# Altium project Pico_VNA.PrjPcb
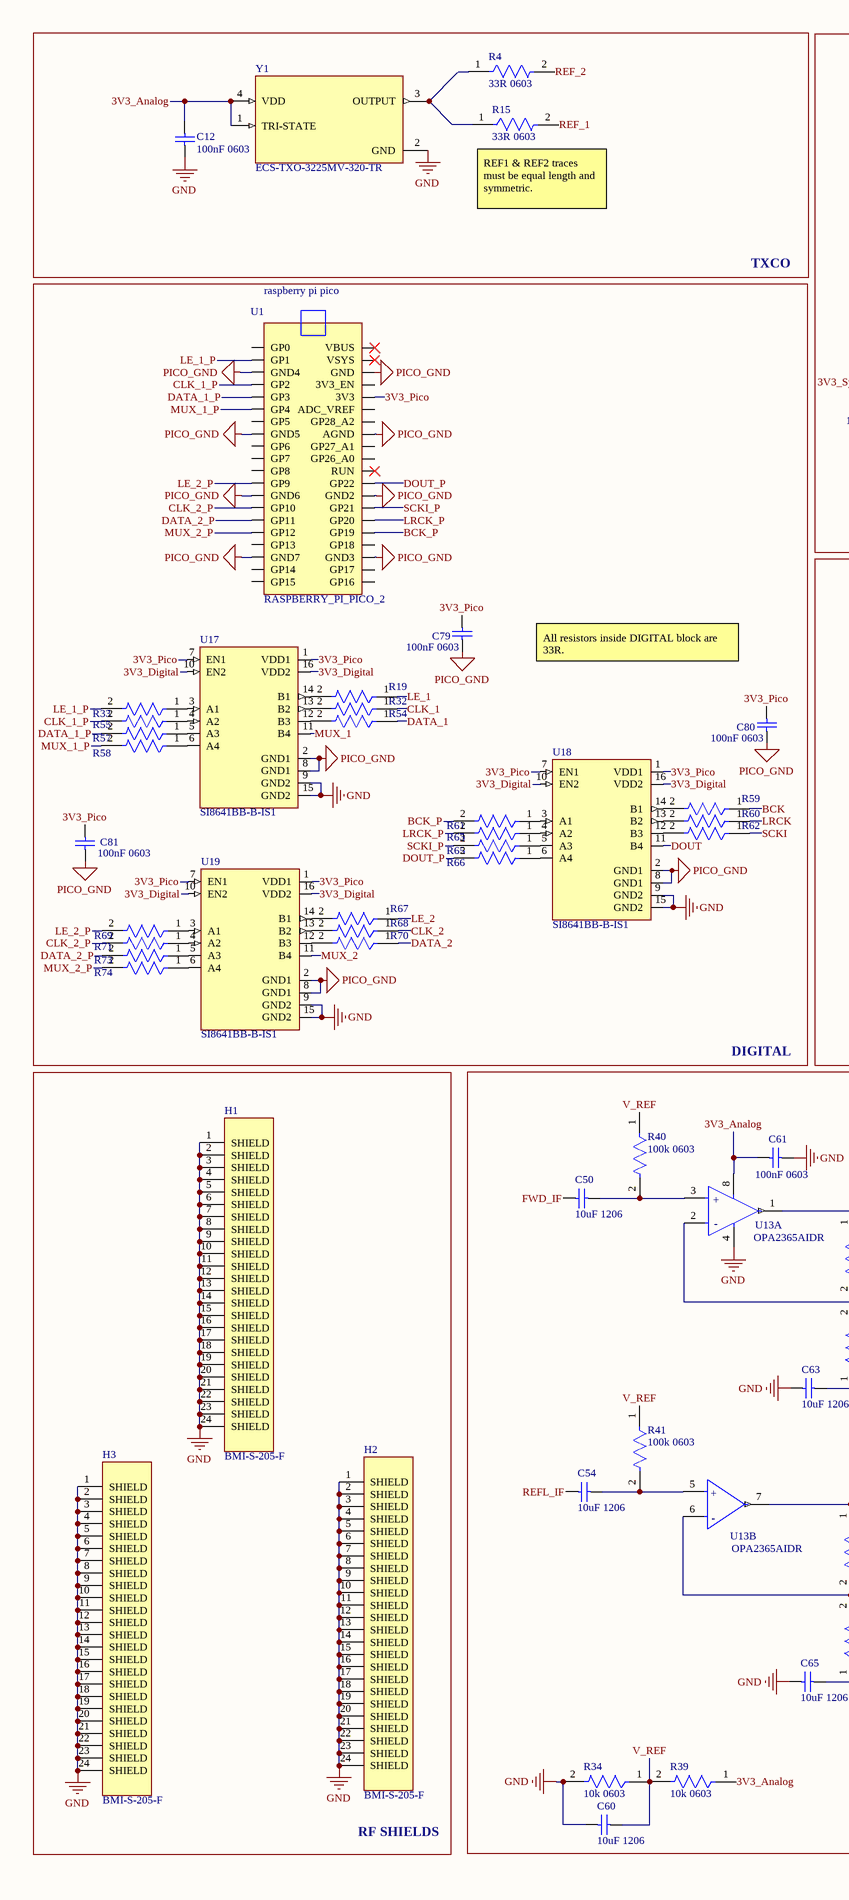
[diagram p0: Main.SchDoc, left]
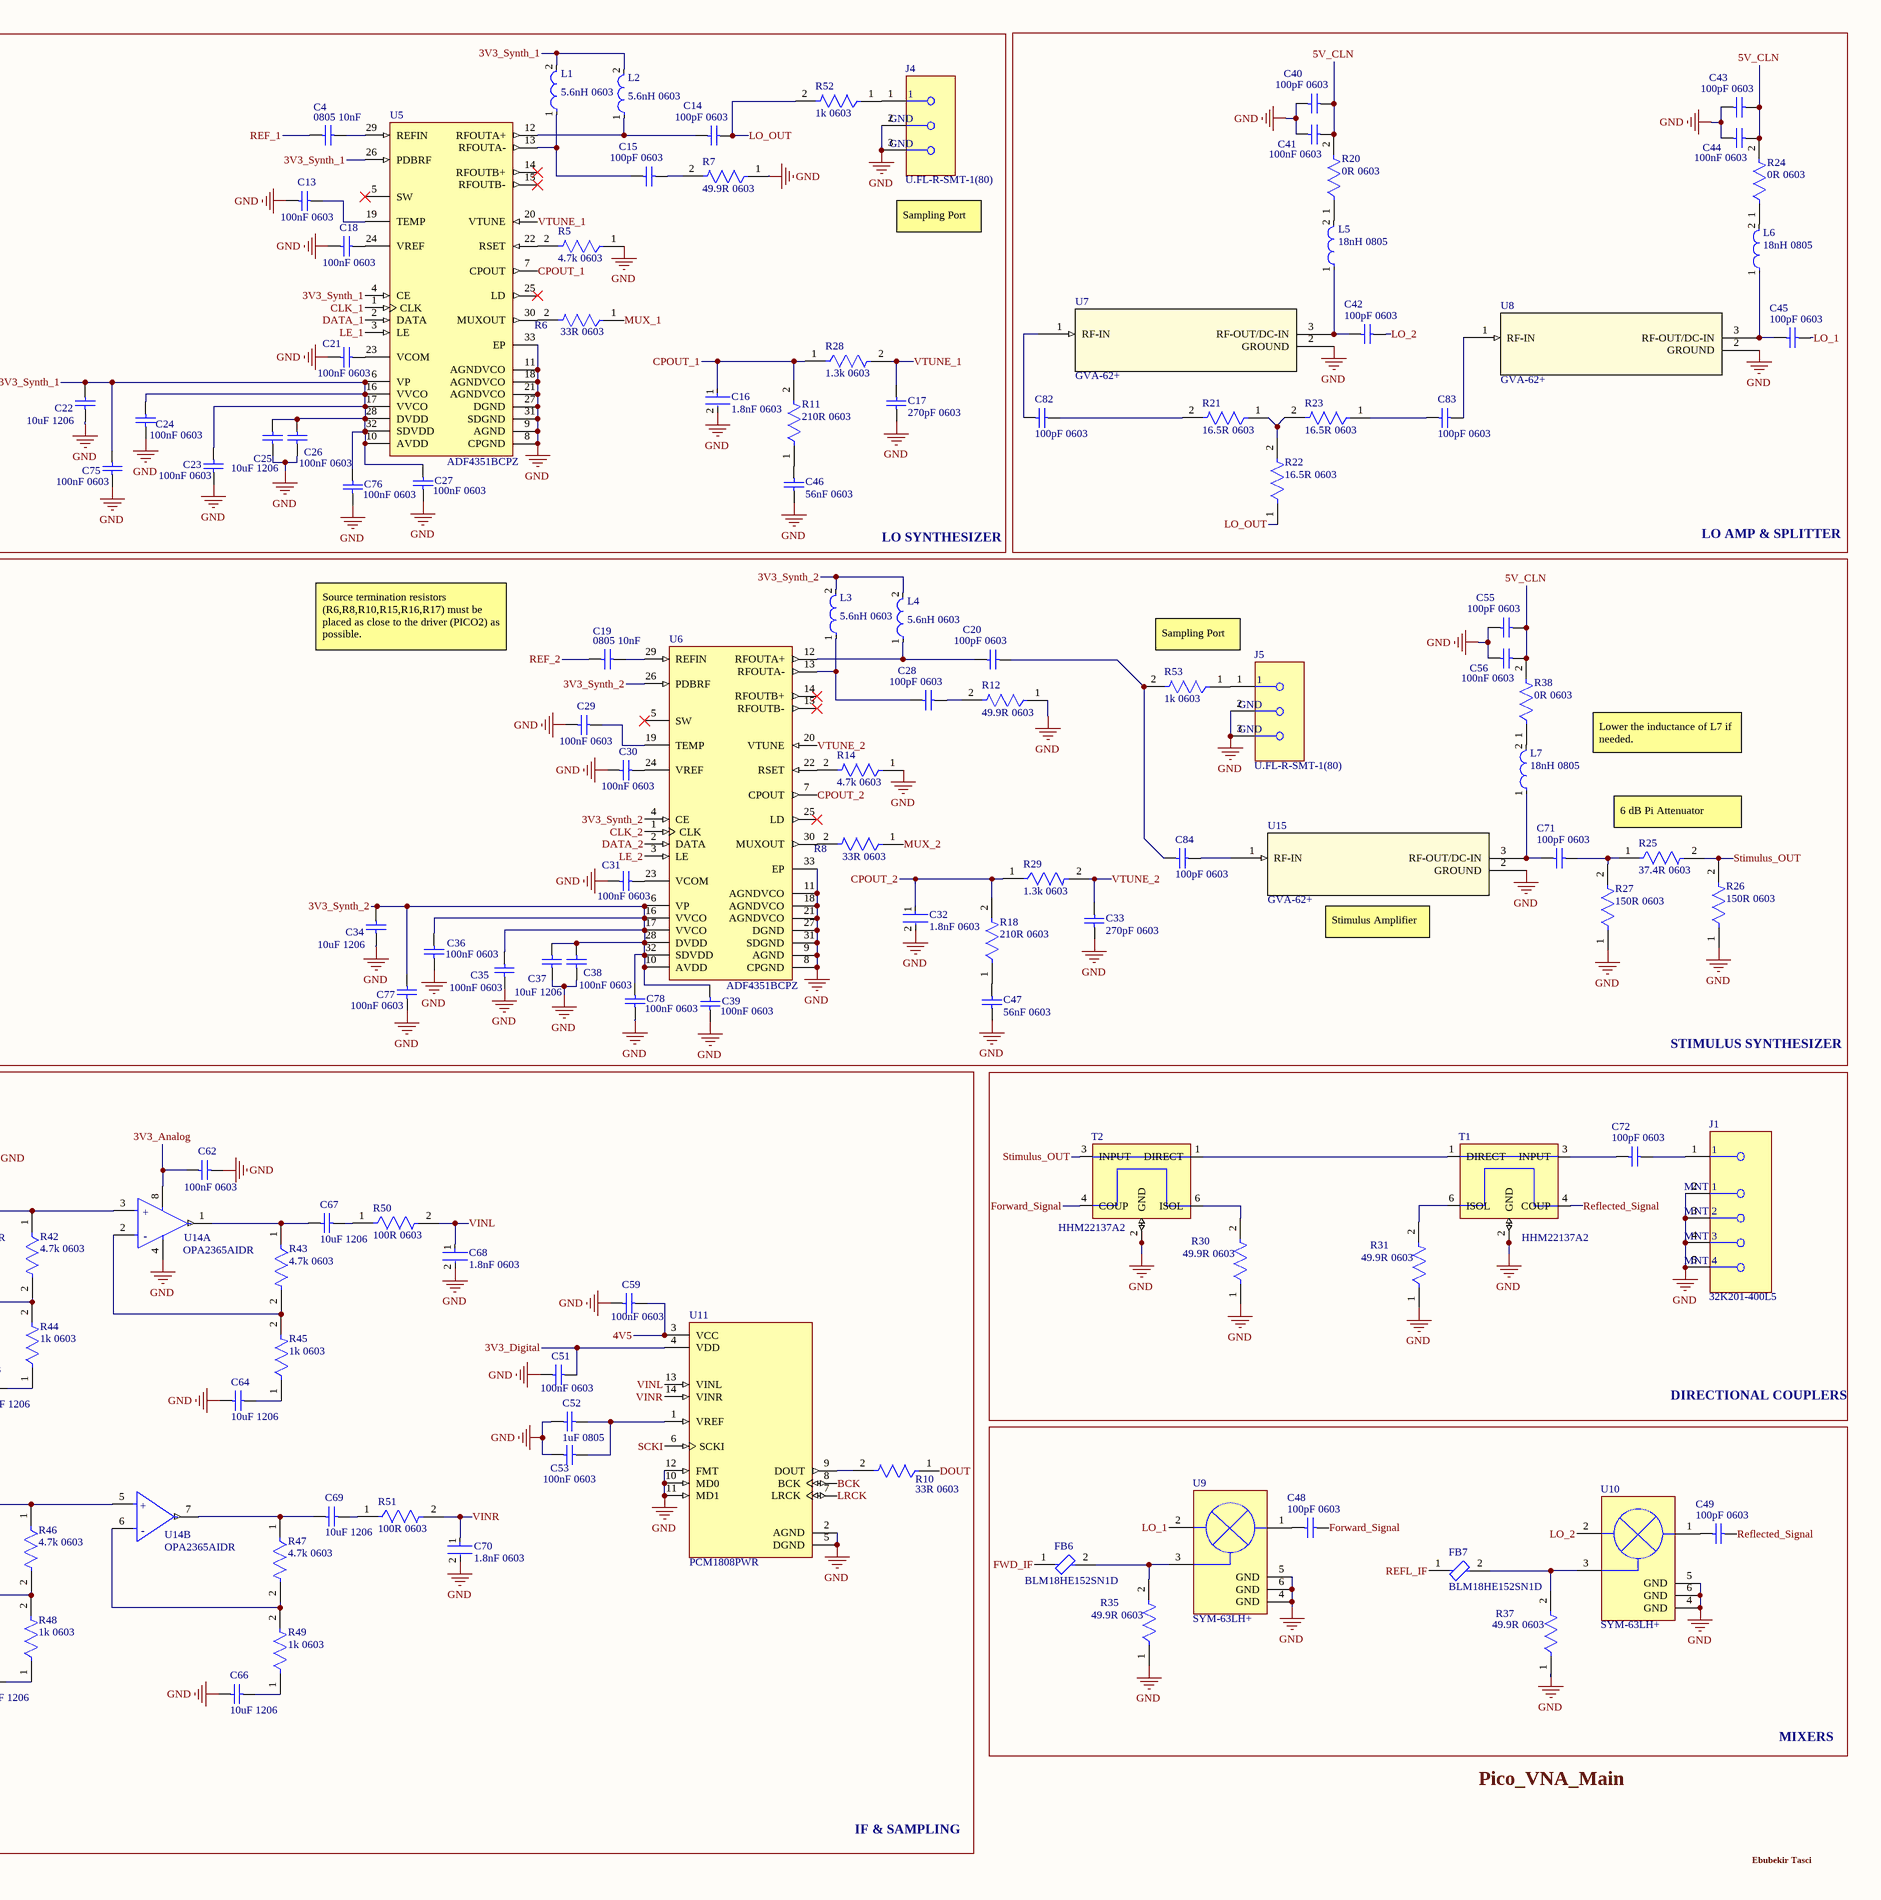
[diagram p1: Main.SchDoc, right]
2 sheets, 199 parts. Net scope: global (net labels, ports and power ports of the same name join across sheets).
Board file: Main.PcbDoc
Sheets:
  Main.SchDoc
  Power.SchDoc

## Sheet Main.SchDoc
size A2; SheetNumber: 1; SheetTotal: 2

### Parts
C4  0805 10nF  [CAPC2013X94X50ML20T25]
C12  100nF 0603  [CAPC0603(1608)100_N]
C13  100nF 0603  [CAPC0603(1608)100_N]
C14  100pF 0603  [CAPC1608X92X38LL15T08]
C15  100pF 0603  [CAPC1608X92X38LL15T08]
C16  1.8nF 0603  [FP-C0603C-CF-MFG]
C17  270pF 0603  [CAPC1608X92X38LL15T08]
C18  100nF 0603  [CAPC0603(1608)100_N]
C19  0805 10nF  [CAPC2013X94X50ML20T25]
C20  100pF 0603  [CAPC1608X92X38LL15T08]
C21  100nF 0603  [CAPC0603(1608)100_N]
C22  10uF 1206  [CAPC1206(3216)190_M]
C23  100nF 0603  [CAPC0603(1608)100_N]
C24  100nF 0603  [CAPC0603(1608)100_N]
C25  10uF 1206  [CAPC1206(3216)190_M]
C26  100nF 0603  [CAPC0603(1608)100_L]
C27  100nF 0603  [CAPC0603(1608)100_L]
C28  100pF 0603  [CAPC1608X92X38LL15T08]
C29  100nF 0603  [CAPC0603(1608)100_N]
C30  100nF 0603  [CAPC0603(1608)100_N]
C31  100nF 0603  [CAPC0603(1608)100_N]
C32  1.8nF 0603  [FP-C0603C-CF-MFG]
C33  270pF 0603  [CAPC1608X92X38LL15T08]
C34  10uF 1206  [CAPC1206(3216)190_M]
C35  100nF 0603  [CAPC0603(1608)100_N]
C36  100nF 0603  [CAPC0603(1608)100_N]
C37  10uF 1206  [CAPC1206(3216)190_M]
C38  100nF 0603  [CAPC0603(1608)100_L]
C39  100nF 0603  [CAPC0603(1608)100_L]
C40  100pF 0603  [CAPC1608X92X38LL15T08]
C41  100nF 0603  [CAPC0603(1608)100_N]
C42  100pF 0603  [CAPC1608X92X38LL15T08]
C43  100pF 0603  [CAPC1608X92X38LL15T08]
C44  100nF 0603  [CAPC0603(1608)100_N]
C45  100pF 0603  [CAPC1608X92X38LL15T08]
C46  56nF 0603  [CAPC1608X90X35LL15T15]
C47  56nF 0603  [CAPC1608X90X35LL15T15]
C48  100pF 0603  [CAPC1608X92X38LL15T08]
C49  100pF 0603  [CAPC1608X92X38LL15T08]
C50  10uF 1206  [CAPC1206(3216)190_M]
C51  100nF 0603  [CAPC0603(1608)100_N]
C52  1uF 0805  [CAPC2013X145X50NL20T25]
C53  100nF 0603  [CAPC0603(1608)100_N]
C54  10uF 1206  [CAPC1206(3216)190_M]
C55  100pF 0603  [CAPC1608X92X38LL15T08]
C56  100nF 0603  [CAPC0603(1608)100_N]
C59  100nF 0603  [CAPC0603(1608)100_N]
C60  10uF 1206  [CAPC1206(3216)190_M]
C61  100nF 0603  [CAPC0603(1608)100_N]
C62  100nF 0603  [CAPC0603(1608)100_N]
C63  10uF 1206  [CAPC1206(3216)190_M]
C64  10uF 1206  [CAPC1206(3216)190_M]
C65  10uF 1206  [CAPC1206(3216)190_M]
C66  10uF 1206  [CAPC1206(3216)190_M]
C67  10uF 1206  [CAPC1206(3216)190_M]
C68  1.8nF 0603  [FP-C0603C-CF-MFG]
C69  10uF 1206  [CAPC1206(3216)190_M]
C70  1.8nF 0603  [FP-C0603C-CF-MFG]
C71  100pF 0603  [CAPC1608X92X38LL15T08]
C72  100pF 0603  [CAPC1608X92X38LL15T08]
C75  100nF 0603  [CAPC0603(1608)100_N]
C76  100nF 0603  [CAPC0603(1608)100_L]
C77  100nF 0603  [CAPC0603(1608)100_N]
C78  100nF 0603  [CAPC0603(1608)100_L]
C79  100nF 0603  [CAPC0603(1608)100_N]
C80  100nF 0603  [CAPC0603(1608)100_N]
C81  100nF 0603  [CAPC0603(1608)100_N]
C82  100pF 0603  [CAPC1608X92X38LL15T08]
C83  100pF 0603  [CAPC1608X92X38LL15T08]
C84  100pF 0603  [CAPC1608X92X38LL15T08]
FB6  BLM18HE152SN1D  [FP-BLM18-0_15-t0_8-IPC_C]
FB7  BLM18HE152SN1D  [FP-BLM18-0_15-t0_8-IPC_C]
H1  BMI-S-205-F  [LAIRD_BMI-S-205-F]
H2  BMI-S-205-F  [LAIRD_BMI-S-205-F]
H3  BMI-S-205-F  [LAIRD_BMI-S-205-F]
J1  32K201-400L5  [FP-32K201-400L5-MFG]
J4  U.FL-R-SMT-1(80)  [FP-U_FL-R-SMT-1_80-MFG]
J5  U.FL-R-SMT-1(80)  [FP-U_FL-R-SMT-1_80-MFG]
L1  5.6nH 0603  [FP-AISC-0603HP-MFG]
L2  5.6nH 0603  [FP-AISC-0603HP-MFG]
L3  5.6nH 0603  [FP-AISC-0603HP-MFG]
L4  5.6nH 0603  [FP-AISC-0603HP-MFG]
L5  18nH 0805  [FP-LQW2BAN_00-MFG]
L6  18nH 0805  [FP-LQW2BAN_00-MFG]
L7  18nH 0805  [FP-LQW2BAN_00-MFG]
R4  33R 0603  [FP-SR0603-MFG]
R5  4.7k 0603  [FP-CPF0603-MFG]
R6  33R 0603  [FP-CPF0603-MFG]
R7  49.9R 0603  [FP-RT0603-MFG]
R8  33R 0603  [FP-CPF0603-MFG]
R10  33R 0603  [FP-CPF0603-MFG]
R11  210R 0603  [FP-AC0603-IPC_B]
R12  49.9R 0603  [FP-RT0603-MFG]
R14  4.7k 0603  [FP-CPF0603-MFG]
R15  33R 0603  [FP-SR0603-MFG]
R18  210R 0603  [FP-AC0603-IPC_B]
R19  33R 0603  [FP-CPF0603-MFG]  (value not drawn)
R20  0R 0603  [FP-HCJ0603-MFG]
R21  16.5R 0603  [FP-RT0603-MFG]
R22  16.5R 0603  [FP-RT0603-MFG]
R23  16.5R 0603  [FP-RT0603-MFG]
R24  0R 0603  [FP-HCJ0603-MFG]
R25  37.4R 0603  [FP-RT0603-MFG]
R26  150R 0603  [FP-RT0603-MFG]
R27  150R 0603  [FP-RT0603-MFG]
R28  1.3k 0603  [FP-TFCR0603-IPC_B]
R29  1.3k 0603  [FP-TFCR0603-IPC_B]
R30  49.9R 0603  [FP-RT0603-MFG]
R31  49.9R 0603  [FP-RT0603-MFG]
R32  33R 0603  [FP-CPF0603-MFG]  (value not drawn)
R33  33R 0603  [FP-CPF0603-MFG]  (value not drawn)
R34  10k 0603  [FP-RT0603-MFG]
R35  49.9R 0603  [FP-RT0603-MFG]
R37  49.9R 0603  [FP-RT0603-MFG]
R38  0R 0603  [FP-HCJ0603-MFG]
R39  10k 0603  [FP-RT0603-MFG]
R40  100k 0603  [FP-RT0603-MFG]
R41  100k 0603  [FP-RT0603-MFG]
R42  4.7k 0603  [FP-CPF0603-MFG]
R43  4.7k 0603  [FP-CPF0603-MFG]
R44  1k 0603  [FP-TFCR0603-MFG]
R45  1k 0603  [FP-TFCR0603-MFG]
R46  4.7k 0603  [FP-CPF0603-MFG]
R47  4.7k 0603  [FP-CPF0603-MFG]
R48  1k 0603  [FP-TFCR0603-MFG]
R49  1k 0603  [FP-TFCR0603-MFG]
R50  100R 0603  [FP-MCT0603-MFG]
R51  100R 0603  [FP-MCT0603-MFG]
R52  1k 0603  [FP-TFCR0603-MFG]
R53  1k 0603  [FP-TFCR0603-MFG]
R54  33R 0603  [FP-CPF0603-MFG]  (value not drawn)
R55  33R 0603  [FP-CPF0603-MFG]  (value not drawn)
R57  33R 0603  [FP-CPF0603-MFG]  (value not drawn)
R58  33R 0603  [FP-CPF0603-MFG]  (value not drawn)
R59  33R 0603  [FP-CPF0603-MFG]  (value not drawn)
R60  33R 0603  [FP-CPF0603-MFG]  (value not drawn)
R61  33R 0603  [FP-CPF0603-MFG]  (value not drawn)
R62  33R 0603  [FP-CPF0603-MFG]  (value not drawn)
R63  33R 0603  [FP-CPF0603-MFG]  (value not drawn)
R65  33R 0603  [FP-CPF0603-MFG]  (value not drawn)
R66  33R 0603  [FP-CPF0603-MFG]  (value not drawn)
R67  33R 0603  [FP-CPF0603-MFG]  (value not drawn)
R68  33R 0603  [FP-CPF0603-MFG]  (value not drawn)
R69  33R 0603  [FP-CPF0603-MFG]  (value not drawn)
R70  33R 0603  [FP-CPF0603-MFG]  (value not drawn)
R71  33R 0603  [FP-CPF0603-MFG]  (value not drawn)
R73  33R 0603  [FP-CPF0603-MFG]  (value not drawn)
R74  33R 0603  [FP-CPF0603-MFG]  (value not drawn)
T1  HHM22137A2  [HHM22137A2]
T2  HHM22137A2  [HHM22137A2]
U1  RASPBERRY_PI_PICO_2  [RASPBERRY_PI_PICO]
U5  ADF4351BCPZ  [ADI-CP-32-2_N]
U6  ADF4351BCPZ  [ADI-CP-32-2_N]
U7  GVA-62+  [DF782_MNC]
U8  GVA-62+  [DF782_MNC]
U9  SYM-63LH+  [FP-SYM-30DMHW+-MFG]
U10  SYM-63LH+  [FP-SYM-30DMHW+-MFG]
U11  PCM1808PWR  [SOP65P640X120-14N]
U13  OPA2365AIDR  [FP-D0008A-MFG]  (parts A,B of 2)
U14  OPA2365AIDR  [FP-D0008A-MFG]  (parts A,B of 2)
U15  GVA-62+  [DF782_MNC]
U17  SI8641BB-B-IS1  [SOIC127P600X265-16N]
U18  SI8641BB-B-IS1  [SOIC127P600X265-16N]
U19  SI8641BB-B-IS1  [SOIC127P600X265-16N]
Y1  ECS-TXO-3225MV-320-TR  [OSC_ECS-TXO-3225MV-320-TR]

### Blocks framed on the sheet
TXCO: C12 R4 R15 Y1
LO SYNTHESIZER: C4 C13-C18 C21-C27 C46 C75 C76 J4 L1 L2 R5-R7 R11 R28 R52 U5
LO AMP & SPLITTER: C40-C45 C82 C83 L5 L6 R20-R24 U7 U8
DIGITAL: C79-C81 R19 R32 R33 R54 R55 R57-R63 R65-R71 R73 R74 U1 U17-U19
STIMULUS SYNTHESIZER: C19 C20 C28-C39 C47 C55 C56 C71 C77 C78 C84 J5 L3 L4 L7 R8 R12 R14 R18 R25-R27 R29 R38 R53 U6 U15
RF SHIELDS: H1-H3
IF & SAMPLING: C50-C54 C59-C70 R10 R34 R39-R51 U11 U13 U14
DIRECTIONAL COUPLERS: C72 J1 R30 R31 T1 T2
MIXERS: C48 C49 FB6 FB7 R35 R37 U9 U10

### Nets
GND: C12.1 C13.2 C16.2 C17.1 C18.2 C21.2 C22.2 C23.1 C24.1 C25.1 C26.2 C27.2 C29.2 C30.2 C31.2 C32.2 C33.1 C34.2 C35.1 C36.1 C37.1 C38.2 C39.2 C40.1 C41.1 C43.1 C44.1 C46.1 C47.1 C51.1 C52.1 C53.1 C55.1 C56.1 C59.1 C60.1 C61.1 C62.1 C63.1 C64.1 C65.1 C66.1 C68.2 C70.2 C75.1 C76.2 C77.1 C78.2 H1.1(SHIELD) H1.2(SHIELD) H1.3(SHIELD) H1.4(SHIELD) H1.5(SHIELD) H1.6(SHIELD) H1.7(SHIELD) H1.8(SHIELD) H1.9(SHIELD) H1.10(SHIELD) H1.11(SHIELD) H1.12(SHIELD) H1.13(SHIELD) H1.14(SHIELD) H1.15(SHIELD) H1.16(SHIELD) H1.17(SHIELD) H1.18(SHIELD) H1.19(SHIELD) H1.20(SHIELD) H1.21(SHIELD) H1.22(SHIELD) H1.23(SHIELD) H1.24(SHIELD) H2.1(SHIELD) H2.2(SHIELD) H2.3(SHIELD) H2.4(SHIELD) H2.5(SHIELD) H2.6(SHIELD) H2.7(SHIELD) H2.8(SHIELD) H2.9(SHIELD) H2.10(SHIELD) H2.11(SHIELD) H2.12(SHIELD) H2.13(SHIELD) H2.14(SHIELD) H2.15(SHIELD) H2.16(SHIELD) H2.17(SHIELD) H2.18(SHIELD) H2.19(SHIELD) H2.20(SHIELD) H2.21(SHIELD) H2.22(SHIELD) H2.23(SHIELD) H2.24(SHIELD) H3.1(SHIELD) H3.2(SHIELD) H3.3(SHIELD) H3.4(SHIELD) H3.5(SHIELD) H3.6(SHIELD) H3.7(SHIELD) H3.8(SHIELD) H3.9(SHIELD) H3.10(SHIELD) H3.11(SHIELD) H3.12(SHIELD) H3.13(SHIELD) H3.14(SHIELD) H3.15(SHIELD) H3.16(SHIELD) H3.17(SHIELD) H3.18(SHIELD) H3.19(SHIELD) H3.20(SHIELD) H3.21(SHIELD) H3.22(SHIELD) H3.23(SHIELD) H3.24(SHIELD) J1.2(MNT_1) J1.3(MNT_2) J1.4(MNT_3) J1.5(MNT_4) J4.2(GND) J4.3(GND) J5.2(GND) J5.3(GND) R5.1 R7.1 R12.1 R14.1 R26.1 R27.1 R30.1 R31.1 R34.2 R35.1 R37.1 T1.2(GND) T1.5(GND) T2.2(GND) T2.5(GND) U5.8(CPGND) U5.9(AGND) U5.11(AGNDVCO) U5.18(AGNDVCO) U5.21(AGNDVCO) U5.27(DGND) U5.31(SDGND) U5.33(EP) U6.8(CPGND) U6.9(AGND) U6.11(AGNDVCO) U6.18(AGNDVCO) U6.21(AGNDVCO) U6.27(DGND) U6.31(SDGND) U6.33(EP) U7.2(GROUND) U8.2(GROUND) U9.4(GND) U9.5(GND) U9.6(GND) U10.4(GND) U10.5(GND) U10.6(GND) U11.2(AGND) U11.5(DGND) U11.10(MD0) U11.11(MD1) U11.12(FMT) U13.4(V-) U14.4(V-) U15.2(GROUND) U17.9(GND2) U17.15(GND2) U18.9(GND2) U18.15(GND2) U19.9(GND2) U19.15(GND2) Y1.2(GND)
PICO_GND: C79.1 C80.1 C81.1 U1.AGND U1.GND U1.GND2 U1.GND3 U1.GND4 U1.GND5 U1.GND6 U1.GND7 U17.2(GND1) U17.8(GND1) U18.2(GND1) U18.8(GND1) U19.2(GND1) U19.8(GND1)
3V3_Analog: C12.2 C61.2 C62.2 R39.1 U13.8(V+) U14.8(V+) Y1.1(TRI-STATE) Y1.4(VDD)
3V3_Digital: C51.2 U11.4(VDD) U17.10(EN2) U17.16(VDD2) U18.10(EN2) U18.16(VDD2) U19.10(EN2) U19.16(VDD2)
3V3_Pico: C79.2 C80.2 C81.2 U1.3V3 U17.1(VDD1) U17.7(EN1) U18.1(VDD1) U18.7(EN1) U19.1(VDD1) U19.7(EN1)
3V3_Synth_1: C22.1 C23.2 C24.2 C25.2 C26.1 C27.1 C75.2 C76.1 L1.2 L2.2 U5.4(CE) U5.6(VP) U5.10(AVDD) U5.16(VVCO) U5.17(VVCO) U5.26(PDBRF) U5.28(DVDD) U5.32(SDVDD)
3V3_Synth_2: C34.1 C35.2 C36.2 C37.2 C38.1 C39.1 C77.2 C78.1 L3.2 L4.2 U6.4(CE) U6.6(VP) U6.10(AVDD) U6.16(VVCO) U6.17(VVCO) U6.26(PDBRF) U6.28(DVDD) U6.32(SDVDD)
4V5: C59.2 U11.3(VCC)
5V_CLN: C40.2 C41.2 C43.2 C44.2 C55.2 C56.2 R20.2 R24.2 R38.2
BCK: R59.1 U11.8(BCK)
BCK_P: R61.2 U1.GP19
CLK_1: R32.1 U5.1(CLK)
CLK_1_P: R55.2 U1.GP2
CLK_2: R68.1 U6.1(CLK)
CLK_2_P: R71.2 U1.GP10
CPOUT_1: C16.1 R11.2 R28.1 U5.7(CPOUT)
CPOUT_2: C32.1 R18.2 R29.1 U6.7(CPOUT)
DATA_1: R54.1 U5.2(DATA)
DATA_1_P: R57.2 U1.GP3
DATA_2: R70.1 U6.2(DATA)
DATA_2_P: R73.2 U1.GP11
DOUT: R10.1 U18.11(B4)
DOUT_P: R66.2 U1.GP22
Forward_Signal: C48.2 T2.4(COUP)
FWD_IF: C50.1 FB6.1
LE_1: R19.1 U5.3(LE)
LE_1_P: R33.2 U1.GP1
LE_2: R67.1 U6.3(LE)
LE_2_P: R69.2 U1.GP9
LO_1: C45.2 U9.2(LO)
LO_2: C42.2 U10.2(LO)
LO_OUT: C14.2 R22.1 R52.2
LRCK: R60.1 U11.7(LRCK)
LRCK_P: R63.2 U1.GP20
MUX_1: R6.1 U17.11(B4)
MUX_1_P: R58.2 U1.GP4
MUX_2: R8.1 U19.11(B4)
MUX_2_P: R74.2 U1.GP12
REF_1: C4.1 R15.2
REF_2: C19.1 R4.2
REFL_IF: C54.1 FB7.1
Reflected_Signal: C49.2 T1.4(COUP)
SCKI: R62.1 U11.6(SCKI)
SCKI_P: R65.2 U1.GP21
Stimulus_OUT: R25.2 R26.2 T2.3(INPUT)
V_REF: C60.2 R34.1 R39.2 R40.1 R41.1
VINL: C68.1 R50.2 U11.13(VINL)
VINR: C70.1 R51.2 U11.14(VINR)
VTUNE_1: C17.2 R28.2 U5.20(VTUNE)
VTUNE_2: C33.2 R29.2 U6.20(VTUNE)
NetC4_2: C4.2 U5.29(REFIN)
NetC13_1: C13.1 U5.19(TEMP)
NetC14_1: C14.1 L2.1 U5.12(RFOUTA+)
NetC15_1: C15.1 L1.1 U5.13(RFOUTA-)
NetC15_2: C15.2 R7.2
NetC18_1: C18.1 U5.24(VREF)
NetC19_2: C19.2 U6.29(REFIN)
NetC20_1: C20.1 L4.1 U6.12(RFOUTA+)
NetC20_2: C20.2 C84.1 R53.2
NetC21_1: C21.1 U5.23(VCOM)
NetC28_1: C28.1 L3.1 U6.13(RFOUTA-)
NetC28_2: C28.2 R12.2
NetC29_1: C29.1 U6.19(TEMP)
NetC30_1: C30.1 U6.24(VREF)
NetC31_1: C31.1 U6.23(VCOM)
NetC42_1: C42.1 L5.1 U7.3(RF-OUT/DC-IN)
NetC45_1: C45.1 L6.1 U8.3(RF-OUT/DC-IN)
NetC46_2: C46.2 R11.1
NetC47_2: C47.2 R18.1
NetC48_1: C48.1 U9.1(RF)
NetC49_1: C49.1 U10.1(RF)
NetC50_2: C50.2 R40.2 U13.3(IN_A+)
NetC52_2: C52.2 C53.2 U11.1(VREF)
NetC54_2: C54.2 R41.2 U13.5(IN_B+)
NetC63_2: C63.2 R44.1
NetC64_2: C64.2 R45.1
NetC65_2: C65.2 R48.1
NetC66_2: C66.2 R49.1
NetC67_1: C67.1 R43.1 U14.1(VOUTA)
NetC67_2: C67.2 R50.1
NetC69_1: C69.1 R47.1 U14.7(VOUTB)
NetC69_2: C69.2 R51.1
NetC71_1: C71.1 L7.1 U15.3(RF-OUT/DC-IN)
NetC71_2: C71.2 R25.1 R27.2
NetC72_1: C72.1 T1.3(INPUT)
NetC72_2: C72.2 J1.1
NetC82_1: C82.1 U7.1(RF-IN)
NetC82_2: C82.2 R21.2
NetC83_1: C83.1 R23.1
NetC83_2: C83.2 U8.1(RF-IN)
NetC84_2: C84.2 U15.1(RF-IN)
NetFB6_2: FB6.2 R35.2 U9.3(IF)
NetFB7_2: FB7.2 R37.2 U10.3(IF)
NetJ4_1: J4.1 R52.1
NetJ5_1: J5.1 R53.1
NetL5_2: L5.2 R20.1
NetL6_2: L6.2 R24.1
NetL7_2: L7.2 R38.1
NetR4_1: R4.1 R15.1 Y1.3(OUTPUT)
NetR5_2: R5.2 U5.22(RSET)
NetR6_2: R6.2 U5.30(MUXOUT)
NetR8_2: R8.2 U6.30(MUXOUT)
NetR10_2: R10.2 U11.9(DOUT)
NetR14_2: R14.2 U6.22(RSET)
NetR19_2: R19.2 U17.14(B1)
NetR21_1: R21.1 R22.2 R23.2
NetR30_2: R30.2 T2.6(ISOL)
NetR31_2: R31.2 T1.6(ISOL)
NetR32_2: R32.2 U17.13(B2)
NetR33_1: R33.1 U17.3(A1)
NetR42_1: R42.1 U13.1(VOUTA) U14.3(IN_A+)
NetR42_2: R42.2 R44.2 U13.2(IN_A-)
NetR43_2: R43.2 R45.2 U14.2(IN_A-)
NetR46_1: R46.1 U13.7(VOUTB) U14.5(IN_B+)
NetR46_2: R46.2 R48.2 U13.6(IN_B-)
NetR47_2: R47.2 R49.2 U14.6(IN_B-)
NetR54_2: R54.2 U17.12(B3)
NetR55_1: R55.1 U17.4(A2)
NetR57_1: R57.1 U17.5(A3)
NetR58_1: R58.1 U17.6(A4)
NetR59_2: R59.2 U18.14(B1)
NetR60_2: R60.2 U18.13(B2)
NetR61_1: R61.1 U18.3(A1)
NetR62_2: R62.2 U18.12(B3)
NetR63_1: R63.1 U18.4(A2)
NetR65_1: R65.1 U18.5(A3)
NetR66_1: R66.1 U18.6(A4)
NetR67_2: R67.2 U19.14(B1)
NetR68_2: R68.2 U19.13(B2)
NetR69_1: R69.1 U19.3(A1)
NetR70_2: R70.2 U19.12(B3)
NetR71_1: R71.1 U19.4(A2)
NetR73_1: R73.1 U19.5(A3)
NetR74_1: R74.1 U19.6(A4)
NetT1_1: T1.1(DIRECT) T2.1(DIRECT)

Not connected (* = marked no-connect by the designer): U1 3V3_EN ADC_VREF GP0 GP5 GP6 GP7 GP8 GP13 GP14 GP15 GP16 GP17 GP18 GP26_A0 GP27_A1 GP28_A2 RUN* VBUS* VSYS*; U5 5(SW)* 14(RFOUTB+)* 15(RFOUTB-)* 25(LD)*; U6 5(SW)* 14(RFOUTB+)* 15(RFOUTB-)* 25(LD)*

### Notes on the sheet
- (near R15) REF1 & REF2 traces must be equal length and symmetric.
- Sampling Port
- All resistors inside DIGITAL block are 33R.
- Source termination resistors (R6,R8,R10,R15,R16,R17) must be placed as close to the driver (PICO2) as possible.
- Lower the inductance of L7 if needed.
- (near R25) 6 dB Pi Attenuator
- (near U15) Stimulus Amplifier
- Pico_VNA_Main
- Ebubekir Tasci
- (in symbol CMP-007-000000-1) raspberry pi pico
- (in symbol CMP-0272-00746-4, part A) +; -
- (in symbol CMP-0272-00746-4, part B) +; -

### Library data of the parts
C4 C19 = CMP-2007-04453-1: Manufacturer: AVX Interconnect / Elco; Part Number: 0805YC103MAT2A
C12 C13 C18 C21 C23 C24 C29-C31 C35 C36 C41 C44 C51 C53 C56 C59 C61 C62 C75 C77 C79-C81 = CMP-1035-02589-1: CAP 100nF 25V ±20% 0603 (1608 Metric) Thickness 1mm SMD; Case-EIA: 0603; Tolerance: Â±20%; Case-Metric: 1608; Value: 100nF; Max Thickness: 1 mm; Technology: SMT; Rated Voltage: 25 V
C14 C15 C20 C28 C40 C42 C43 C45 C48 C49 C55 C71 C72 C82-C84 = CMP-2006-01182-1: Manufacturer: Vitramon; Part Number: VJ0603A101FXAAC
C16 C32 C68 C70 = CMP-03020-009150-1: CAP CER 1800PF 25V X7R 0603; Manufacturer Part Number: C0603C182J3RACTU; Manufacturer: KEMET; Tolerance: 0.05; Temperature Coefficient: 30ppm/°C; Capacitance: 1,800 pF; Material: Ceramic; Value: 1,800 pF; Automotive Grade: Grade 1; Temperature Characteristic: X7R; ComponentLink2URL: https://api.kemet.com/component-edge/download/datasheet/C0603C100J5GACAUTO.pdf; Digikey Description: CAP CER 1800PF 25V X7R 0603; Device Class L3: Ceramic Capacitors; Voltage Rating: 25 V; Octopart: https://octopart.com/c0603c182j3ractu-kemet-17061586; ComponentLink2Description: Datasheet; Temperature Range Low: -55°C; Category: Cap; Device Class L2: Capacitors; Temperature Range High: +125°C; RoHS: TRUE; Height: 0.87mm; Package: C0603C-CF; Automotive: Yes; Device Class L1: Passive Components; Lead Free: Yes; Temperature: -55°C to +125°C
C17 C33 = CMP-2006-01334-1: Part Number: VJ0603A271KXAAC; Manufacturer: Vitramon
C22 C25 C34 C37 C50 C54 C60 C63-C67 C69 = CMP-1037-04973-1: CAP 10uF 16V ±5% 1206 (3216 Metric) Thickness 1.9mm SMD; Case-EIA: 1206; Case-Metric: 3216; Tolerance: Â±5%; Rated Voltage: 16 V; Value: 10uF; Max Thickness: 1.9 mm; Technology: SMT
C26 C27 C38 C39 C76 C78 = CMP-1035-00228-1: CAP 100nF 16V ±0.1pF 0603 (1608 Metric) Thickness 1mm SMD; Case-EIA: 0603; Tolerance: Â±0.1pF; Case-Metric: 1608; Max Thickness: 1 mm; Technology: SMT; Value: 100nF; Rated Voltage: 16 V
C46 C47 = CMP-2006-04522-1: Part Number: 0603YC563JAT2A; Manufacturer: AVX Interconnect / Elco
C52 = CMP-2007-01121-1: Part Number: C0805C105J3RACTU; Manufacturer: Kemet
FB6 FB7 = CMP-0686-00368-3: Chip Ferrite Bead, 0603, 1500Ω @ 100MHz, 0.5Ω, 25%, 500mA; Impedance: 1.5kR; DC Resistance (DCR): 500mR; Number of Circuits: 1; Test Frequency: 100MHz; Case/Package: 0603; Max Operating Temperature: 125°C; Package Quantity: 1; Max DC Current: 500mA; Tolerance: 25%; Core Material: Ferrite; Width: 0.8mm; Number of Pins: 2; Depth: 0.8mm; Radiation Hardening: No; Case Code (Imperial): 0603; Min Operating Temperature: -55°C; Termination: SMD/SMT; Material: Ferrite; Military Standard: Not; Number of Lines: 1; DC Current: 500mA; Length: 1.6mm; REACH SVHC: No SVHC; Lead Free: Lead Free; Current Rating: 500mA; Max Current Rating: 500mA; Packaging: Tape and Reel; Case Code (Metric): 1608; Height: 0.8mm
H1-H3 = CMP-058-000000-1: RF Shield Frame 1.000 _25.40mm_ X 1.500 _38.10mm_ Solder; MF: Laird Technologies; Source: SnapEDAsch.SchLib; MP: BMI-S-205-F; Component Type: Standard; Pin Count: 24; Availability: Unavailable; Price: None; SnapEDA_Link: https://www.snapeda.com/parts/BMI-S-205-F/Laird%20Technologies%20EMI/view-part/596236/?ref=snap; Value: *; Package: TSSOP-14 Laird; Design Item ID: BMI-S-205-F
J1 = CMP-0751-00005-2: CONN SMA JACK R/A 50OHM PCB; Gender: Female; Body Plating: Gold; Dielectric Material: PTFE; Mating Cycles: 500; Max Frequency: 18GHz; Body Material: Brass; Number of Ports: 1; Impedance: 50R; Voltage Rating: 480V; RoHS Compliant: Yes; Termination: Solder; Housing Color: Gold; Case/Package: SMA; Series: -; Center Contact Plating: Gold; Contact Plating: Gold; Max Operating Temperature: 165°C; Contact Material: Copper; Fastening Type: Threaded; Packaging: Bulk; Connector Type: SMA; Min Operating Temperature: -65°C
J4 J5 = CMP-11598-000004-1: CONN U.FL RCPT STR 50 OHM SMD; Mating Cycles: 30; Impedance: 50R; Body Plating: Silver; Center Contact Plating: Gold; Body Material: Bronze; Dielectric Material: Polymer; Connector Type: Receptacle; Number of Ports: 1; Max Frequency: 6GHz; Mount: Surface Mount; Termination: Solder; Case/Package: SMD/SMT; Min Operating Temperature: -40°C; Series: U.FL; Max Operating Temperature: 90°C; Fastening Type: SNAP-ON; RoHS Compliant: Yes; Packaging: Tape and Reel; Package Quantity: 10000; Contact Material: Brass; Housing Color: Beige; Lead Free: Lead Free
L1-L4 = CMP-27750-000002-1: Height - Seated (Max): 0.04inch; RoHS Compliant: Yes; Height: 1.02mm; Case Code (Metric): 1608; Package Quantity: 1; Packaging: Tape and Reel; Termination: SMD/SMT; Case Code (Imperial): 0603; Width: 1.12mm; Length: 0.071inch; Case/Package: 0603; Mount: Surface Mount
L5-L7 = CMP-06042-010439-1: 18 nH Unshielded Drum Core, Wirewound Inductor 800 mA 130mOhm 0805 (2012 Metric) / 0805CT-180EGTS; Test Frequency: 250MHz; Max DC Current: 800mA; Current Rating: 600mA; Q Factor: 50; Tolerance: 5%; DC Resistance (DCR): 130mR; Core Material: Air; Self Resonant Frequency: 3.1GHz; Depth: 1.73mm; Case/Package: 0805; Resistor Type: Wirewound; Military Standard: Not; Packaging: Tape and Reel; Height: 1.42mm; Mount: Surface Mount; Case Code (Metric): 2015; Radiation Hardening: No; Inductance: 18nH; Shielding: Unshielded; Length: 0.082inch; DC Current: 600mA; Weight: 0.000494oz; Max Operating Temperature: 125°C; Height - Seated (Max): 0.06inch; Width: 1.5mm; Package Quantity: 2000; Case Code (Imperial): 0806; Termination: SMD/SMT; Min Operating Temperature: -55°C
R4 R15 = CMP-03412-011068-1: RES 33 OHM 1% 1/4W 0603; Manufacturer: Yageo; Manufacturer Part Number: SR0603FR-7T33RL; Resistance: 33Ω; Value: 33Ω; Automotive Grade: Grade 0; Voltage Rating: 75V; Power Rating: 0.25W; Tolerance: 0.01; ComponentLink2Description: Datasheet; Device Class L1: Passive Components; Package: SR0603; Temperature: -55°C to +155°C; Composition: Thick Film; RoHS: TRUE; Ipc Land Pattern Name: RESC16080X45; Automotive: Yes; Temperature Range Low: -55°C; Height: 0.55mm; Category: Res; Digikey Description: RES 33 OHM 1% 1/4W 0603; Series: SR; ComponentLink2URL: http://www.yageo.com/documents/recent/PYu-SR_D_F%20tol_RoHS_L_3.pdf; Device Class L2: Resistors; Temperature Range High: +155°C; Device Class L3: Chip SMD Resistors; Octopart: https://octopart.com/sr0603fr-7t33rl-yageo-92673856; Footprint Url: http://www.yageo.com/exep/pages/download/literatures/PYu-R_Mount_10.pdf; Lead Free: Yes
R5 R14 R42 R43 R46 R47 = CMP-03211-011109-1: RES SMD 4.7kΩ 0.1% 1/16W 0603; Manufacturer: TE Connectivity; Manufacturer Part Number: CPF0603B15RE; Power Rating: 0.063W; Temperature Coefficient: 25ppm/°C; Voltage Rating: 50V; Height: 0.55mm; Tolerance: 0.1%; Value: 4.7kΩ; Device Class L1: Passive Components; Temperature Range Low: -55°C; ComponentLink2Description: Datasheet; Device Class L3: Chip SMD Resistors; Package: CPF0603; Device Class L2: Resistors; Series: CPF; Temperature: -55°C to +155°C; packaging: 5k Reel; Temperature Range High: +155°C; Automotive: No; Composition: Thin Film; Ipc Land Pattern Name: RESC15580X45; RoHS: TRUE; ComponentLink2URL: https://www.te.com/commerce/DocumentDelivery/DDEController?Action=showdoc&DocId=Data+Sheet%7F1773200%7FM%7Fpdf%7FEnglish%7FENG_DS_1773200_M.pdf%7F3-1676481-2; Category: Res; Octopart: https://octopart.com/cpf0603b15re-te+connectivity-23283246; Lead Free: Yes; Resistance: 4.7kΩ; octopart_url: https://octopart.com/cpf0603b15re-te+connectivity-23283246
R6 R8 R10 R19 R32 R33 R54 R55 R57-R63 R65-R71 R73 R74 = CMP-03211-006902-1: RES SMD 33Ω 0.1% 1/16W 0603; Manufacturer Part Number: CPF0603B430RE1; Manufacturer: TE Connectivity; Power Rating: 0.063W; Temperature Coefficient: 25ppm/°C; Voltage Rating: 50V; Lead Free: Yes; Temperature: -55°C to +155°C; Device Class L3: Chip SMD Resistors; RoHS: TRUE; packaging: 1k Reel; ComponentLink2Description: Datasheet; Category: Res; Resistance: 33Ω; Octopart: https://octopart.com/cpf0603b430re1-te+connectivity-22738753; Automotive: No; Height: 0.55mm; Package: CPF0603; octopart_url: https://octopart.com/cpf0603b430re1-te+connectivity-22738753; ComponentLink2URL: https://www.te.com/commerce/DocumentDelivery/DDEController?Action=showdoc&DocId=Data+Sheet%7F1773200%7FM%7Fpdf%7FEnglish%7FENG_DS_1773200_M.pdf%7F3-1676481-2; Series: CPF; Composition: Thin Film; Device Class L2: Resistors; Tolerance: 0.1%; Ipc Land Pattern Name: RESC15580X45; Value: 33Ω; Device Class L1: Passive Components; Temperature Range High: +155°C; Temperature Range Low: -55°C
R7 R12 R30 R31 R35 R37 = CMP-03412-022019-1: RES SMD 49.9 OHM 1% 1/10W 0603; Manufacturer: Yageo; Manufacturer Part Number: RT0603FRD0749R9L; Resistance: 49.9Ω; Tolerance: 0.01; Temperature Coefficient: 25 ppm/°C; Voltage Rating: 75V; Value: 49.9Ω; Power Rating: 0.1W; Temperature Range Low: -55°C; Device Class L3: Chip SMD Resistors; Ipc Land Pattern Name: RESC16080X45; Device Class L1: Passive Components; Height: 0.55mm; ComponentLink2Description: Datasheet; Temperature Range High: +155°C; Footprint Url: http://www.yageo.com/exep/pages/download/literatures/PYu-R_Mount_10.pdf; RoHS: TRUE; Digikey Description: RES SMD 49.9 OHM 1% 1/10W 0603; Temperature: -55°C to +155°C; Automotive: No; Composition: Thin Film; Package: RT0603; Octopart: https://octopart.com/rt0603frd0749r9l-yageo-71395396; Series: RT; Device Class L2: Resistors; ComponentLink2URL: http://www.yageo.com/documents/recent/PYu-RT_1-to-0.01_RoHS_L_9.pdf; Lead Free: Yes; Category: Res
R11 R18 = CMP-03412-003885-2: RES 210Ω 1.00% 0.1W 0603; Temperature Coefficient: 100ppm/°C; Power Rating: 100mW; Voltage Rating: 50V; Tolerance: 1%; Termination: SMD/SMT; Case Code (Imperial): 0603; Width: 0.8mm; RoHS Compliant: Yes; Resistor Type: Thick Film; Max Power Dissipation: 100mW; Max Operating Temperature: 155°C; Case Code (Metric): 1608; Series: AC; Features: Moisture Resistant; Resistance: 210R; Case/Package: 0603; Packaging: Tape and Reel; Length: 0.063inch; Number of Terminations: 2; Min Operating Temperature: -55°C; Height: 0.022inch
R20 R24 R38 = CMP-26527-000122-1: RES 0 OHM JUMPER 1/4W 0603; Resistance: 0mR; Termination: Wraparound; Mount: Surface Mount; Min Operating Temperature: -55°C; Number of Terminations: 2; Packaging: Tape and Reel; Case Code (Imperial): 0603; Height: 0.021inch; RoHS Compliant: Yes; Width: 0.031inch; Package Quantity: 5000; Max Operating Temperature: 155°C; Radiation Hardening: No; Case/Package: 0603; Length: 0.061inch; Case Code (Metric): 1608
R21-R23 = CMP-03412-005655-1: RES SMD 16.5 OHM 1% 1/10W 0603; Manufacturer Part Number: RT0603FRE0716R5L; Manufacturer: Yageo; Resistance: 16.5Ω; Value: 16.5Ω; Temperature Coefficient: 50 ppm/°C; Tolerance: 0.01; Power Rating: 0.1W; Voltage Rating: 75V; Mouser Description: Thin Film Resistors - SMD 1/10W 16.5 ohm 1% 50ppm; Automotive: No; ComponentLink2URL: http://www.yageo.com/documents/recent/PYu-RT_1-to-0.01_RoHS_L_9.pdf; Lead Free: Yes; Device Class L3: Chip SMD Resistors; Package: RT0603; Ipc Land Pattern Name: RESC16080X45; Series: RT; Temperature: -55°C to +155°C; RoHS: TRUE; Device Class L2: Resistors; Temperature Range Low: -55°C; Category: Res; Composition: Thin Film; Footprint Url: http://www.yageo.com/exep/pages/download/literatures/PYu-R_Mount_10.pdf; Height: 0.55mm; Device Class L1: Passive Components; ComponentLink2Description: Datasheet; Digikey Description: RES SMD 16.5 OHM 1% 1/10W 0603; Octopart: https://octopart.com/rt0603fre0716r5l-yageo-1472148; Temperature Range High: +155°C
R25 = CMP-03412-012358-1: RES SMD 37.4 OHM 0.1% 1/10W 0603; Manufacturer: Yageo; Manufacturer Part Number: RT0603BRD0737R4L; Temperature Coefficient: 25 ppm/°C; Power Rating: 0.1W; Value: 37.4Ω; Voltage Rating: 75V; Tolerance: 0.001; Package: RT0603; Composition: Thin Film; Lead Free: Yes; Octopart: https://octopart.com/rt0603brd0737r4l-yageo-1279906; Mouser Description: Thin Film Resistors - SMD 1/10W 37.4 ohm .1% 25ppm; Temperature Range High: +155°C; Device Class L3: Chip SMD Resistors; Automotive: No; Series: RT; Device Class L2: Resistors; Height: 0.55mm; Digikey Description: RES SMD 37.4 OHM 0.1% 1/10W 0603; Temperature Range Low: -55°C; ComponentLink2Description: Datasheet; Resistance: 37.4Ω; RoHS: TRUE; Footprint Url: http://www.yageo.com/exep/pages/download/literatures/PYu-R_Mount_10.pdf; Category: Res; Ipc Land Pattern Name: RESC16080X45; Temperature: -55°C to +155°C; ComponentLink2URL: http://www.yageo.com/documents/recent/PYu-RT_1-to-0.01_RoHS_L_9.pdf; Device Class L1: Passive Components
R26 R27 = CMP-2000-04520-2: RES 150 OHM 1/10W .1% SMD 0603; Manufacturer: Yageo; Manufacturer Part Number: RT0603BRE07150RL; Resistance: 150Ω; Tolerance: 0.001; Value: 150Ω; Voltage Rating: 75V; Power Rating: 0.1W; Temperature Coefficient: 50 ppm/°C; Composition: Thin Film; RoHS: TRUE; Device Class L1: Passive Components; Temperature Range Low: -55°C; Device Class L2: Resistors; Octopart: https://octopart.com/rt0603bre07150rl-yageo-1267230; Automotive: No; Series: RT; Package: RT0603; ComponentLink2Description: Datasheet; Digikey Description: RES 150 OHM 1/10W .1% SMD 0603; Device Class L3: Chip SMD Resistors; Lead Free: Yes; Temperature: -55°C to +155°C; Category: Res; ComponentLink2URL: http://www.yageo.com/documents/recent/PYu-RT_1-to-0.01_RoHS_L_9.pdf; Footprint Url: http://www.yageo.com/exep/pages/download/literatures/PYu-R_Mount_10.pdf; Temperature Range High: +155°C; Ipc Land Pattern Name: RESC16080X45; Height: 0.55mm
R28 R29 = CMP-250906-187165-1: RES Thin Film,  1.3kΩ, 0.1%, 0.1W, 25ppm/°C, 0603
R34 R39 = CMP-03412-024743-1: RES SMD 10K OHM 0.05% 1/10W 0603; Manufacturer: Yageo; Manufacturer Part Number: RT0603WRE0710KL; Power Rating: 0.1W; Value: 10KΩ; Voltage Rating: 75V; Tolerance: 0.0005; Temperature Coefficient: 50 ppm/°C; Height: 0.55mm; ComponentLink2URL: http://www.yageo.com/documents/recent/PYu-RT_1-to-0.01_RoHS_L_9.pdf; Mouser Description: Res SMD 10K Ohm 0.05% 1/10W 0603; Device Class L1: Passive Components; Octopart: https://octopart.com/rt0603wre0710kl-yageo-71396825; Lead Free: Yes; RoHS: TRUE; ComponentLink2Description: Datasheet; Package: RT0603; Ipc Land Pattern Name: RESC16080X45; Automotive: No; Temperature: -55°C to +155°C; Series: RT; Resistance: 10KΩ; Footprint Url: http://www.yageo.com/exep/pages/download/literatures/PYu-R_Mount_10.pdf; Temperature Range Low: -55°C; Digikey Description: RES SMD 10K OHM 0.05% 1/10W 0603; Category: Res; Device Class L3: Chip SMD Resistors; Temperature Range High: +155°C; Device Class L2: Resistors; Composition: Thin Film
R40 R41 = CMP-03412-006967-1: RT0603 100KΩ 0.1W 50 ppm/°C 1.00%; Manufacturer: Yageo; Manufacturer Part Number: RT0603FRE10100KL; Voltage Rating: 75V; Tolerance: 0.01; Composition: Thin Film; Series: RT; Ipc Land Pattern Name: RESC16080X45; Height: 0.55mm; ComponentLink2Description: Datasheet; Temperature: -55°C to +155°C; Octopart: https://octopart.com/rt0603fre10100kl-yageo-22252408; Temperature Range High: +155°C; Automotive: No; Lead Free: Yes; Temperature Range Low: -55°C; Category: Res; Device Class L2: Resistors; Power Rating: 0.1W; Footprint Url: http://www.yageo.com/exep/pages/download/literatures/PYu-R_Mount_10.pdf; Temperature Coefficient: 50 ppm/°C; Device Class L3: Chip SMD Resistors; ComponentLink2URL: http://www.yageo.com/documents/recent/PYu-RT_1-to-0.01_RoHS_L_9.pdf; Resistance: 100KΩ; Device Class L1: Passive Components; Package: RT0603; Value: 100KΩ; RoHS: TRUE
R44 R45 R48 R49 R52 R53 = CMP-250906-149963-1: RES Thin Film,  1kΩ, 0.1%, 0.1W, 25ppm/°C, 0603
R50 R51 = CMP-02407-008087-1: RES SMD 100 OHM 1% 1/8W 0603; Power Rating: 125mW; Voltage Rating: 75V; Max Operating Temperature: 175°C; Case Code (Imperial): 0603; Height: 0.45mm; Packaging: Tape and Reel; Resistance: 100R; Min Operating Temperature: -55°C; Termination: SMD/SMT; Case/Package: 0603; Case Code (Metric): 1608; Width: 0.85mm; Length: 1.55mm; Tolerance: 1%; Composition: Thin Film; Weight: 6.7E-05oz
T1 T2 = CMP-012-00000-1: RF Directional Coupler General Purpose 0603 (1608 Metric), 6 PC Pad; MF: TDK Corporation; Component Type: Standard; Pins: 6; Source: HHM22137A2.SchLib; Design Item ID: HHM22137A2; Case/Package: 0603 TDK Corporation; SnapEDA_Link: https://www.snapeda.com/parts/HHM22137A2/TDK/view-part/?ref=snap; MP: HHM22137A2; Value: *; Check_prices: https://www.snapeda.com/parts/HHM22137A2/TDK/view-part/?ref=eda
U1 = CMP-007-000000-1: Raspberry Pi Board, Arm Cortex-M0+; Core Architecture:Arm; Core Sub-Architecture:Cortex-M0+; Kit Contents:Raspberry Pi Pico Board; No. Of Bits:32Bit; Silicon Core Number:Rp2040; Silicon Manufacturer:Raspberry Pi; Package: None; Component Type: Standard; Value: *; MF: Raspberry Pi; Pin Count: 40; Check_prices: https://www.snapeda.com/parts/RASPBERRY%20PI%20PICO/Raspberry+Pi/view-part/?ref=eda; Source: RASPBERRY_PI_PICO.SchLib; Design Item ID: RASPBERRY_PI_PICO; SnapEDA_Link: https://www.snapeda.com/parts/RASPBERRY%20PI%20PICO/Raspberry+Pi/view-part/?ref=snap; MP: RASPBERRY PI PICO
U5 U6 = CMP-0287-00014-1: Wideband Synthesizer with Integrated VCO, CP-32-2, Pb-Free, 490 Tray; Norm Phase Noise (dBc/Hz): -221dBc; Single/Dual: Single; Supply Current: 110mA; Max REFin (MHz): 250MHz; Max RF Input (MHz): 4.4GHz; Frequency Range: 35MHz-4.4GHz; RF Prescalers: 4/5,8/9; ComponentLink2URL: http://www.analog.com/static/imported-files/data_sheets/ADF4351.pdf; ComponentLink1URL: www.analog.com; ComponentLink1Description: Manufacturer URL; PackageDescription: 32-Lead Lead Frame Chip Scale Package [LFCSP_VQ]; Code_JEDEC: MO-220-VHHD-2; DatasheetVersion: Rev. Pr D; ComponentLink3URL: http://www.analog.com/static/imported-files/packages/414143737956480539664569CP_32_2.pdf; PackageReference: CP-32-2; PackageVersion: Jan-2005; ComponentLink2Description: Datasheet; ComponentLink3Description: Package Specification
U7 U8 U15 = GVA-63+: No Description Available; Manufacturer_Name: Mini Circuits; Type: RF; Copyright: Copyright (C) 2026 Ultra Librarian. All rights reserved.; Manufacturer_Part_Number: GVA-62+; RefDes: RefDes
U9 U10 = CMP-199893-000002-1: RF Mixer IC Cellular, GPS, ISM, PCS, WCDMA 1MHz ~ 6GHz; RoHS Compliant: Yes
U11 = CMP-052-000000-1: 24-bit, 99-dB SNR, 96-kHz stereo ADC with single-ended inputs; MF: Texas Instruments; SnapEDA_Link: https://www.snapeda.com/parts/PCM1808PWR/Texas+Instruments/view-part/?ref=snap; Pin Count: 14; Component Type: Standard; Design Item ID: PCM1808PWR; Value: *; Package: TSSOP-14 Texas Instruments; Check_prices: https://www.snapeda.com/parts/PCM1808PWR/Texas+Instruments/view-part/?ref=eda; MP: PCM1808PWR; Source: PCM1808PWR.SchLib
U13 U14 = CMP-0272-00746-4: IC OPAMP GP 2 CIRCUIT 8SOIC; Max Supply Voltage: 5.5V; Input Offset Voltage (Vos): 200uV; Output Current per Channel: 65mA; Operating Supply Current: 4.6mA; Number of Amplifiers: 2; Slew Rate: 25V/µs; Gain Bandwidth Product: 50MHz; Common Mode Rejection Ratio: 100dB; Nominal Supply Current: 5mA; Voltage Gain: 120dB; Input Bias Current: 10pA; Min Supply Voltage: 2.2V; Case/Package: D; Package Quantity: 1; Radiation Hardening: No; Packaging: Tape and Reel; Number of Circuits: 2; Output Current: 65mA; Contact Plating: Gold; Power Supply Rejection Ratio (PSRR): 100dB; Unity Gain Bandwidth Product: 50MHz; Max Operating Temperature: 125°C; REACH SVHC: No SVHC; Max I/O Voltage: 200uV; Min Operating Temperature: -40°C; Number of Elements: 2; Lead Free: Lead Free; Bandwidth: 50MHz; Number of Channels: 2; Number of Pins: 8
U17-U19 = CMP-060-000000-1: General Purpose Digital Isolator 2500Vrms 4 Channel 150Mbps 35kV/Âµs CMTI 16-SOIC (0.154, 3.90mm Width); MF: Silicon Labs; SnapEDA_Link: https://www.snapeda.com/parts/SI8641BB-B-IS1/Silicon+Labs/view-part/?ref=snap; MP: SI8641BB-B-IS1; Package: SOIC-16 Silicon Labs; Pin Count: 16; Value: *; Design Item ID: SI8641BB-B-IS1; Check_prices: https://www.snapeda.com/parts/SI8641BB-B-IS1/Silicon+Labs/view-part/?ref=eda; Component Type: Standard; Source: SI8641BB-B-IS1.SchLib
Y1 = CMP-041-000000-1: TCXO Oscillators 32.000 MHZ Multi-Volt +1.7 3.6V HCMOS TCXO +/-2.5 ppm -30 +85 C 3.2x 2.5mm RoHS; MF: ECS; Pin Count: 4; Check_prices: https://www.snapeda.com/parts/ECS-TXO-3225MV-320-TR/ECS/view-part/?ref=eda; Design Item ID: ECS-TXO-3225MV-320-TR; Component Type: Standard; Value: *; Source: ECS-TXO-3225MV-320-TR.SchLib; SnapEDA_Link: https://www.snapeda.com/parts/ECS-TXO-3225MV-320-TR/ECS/view-part/?ref=snap; MP: ECS-TXO-3225MV-320-TR; Package: ECS-TXO-3225MV-0-4 ECS

## Sheet Power.SchDoc
size A4; SheetNumber: 2; SheetTotal: 2
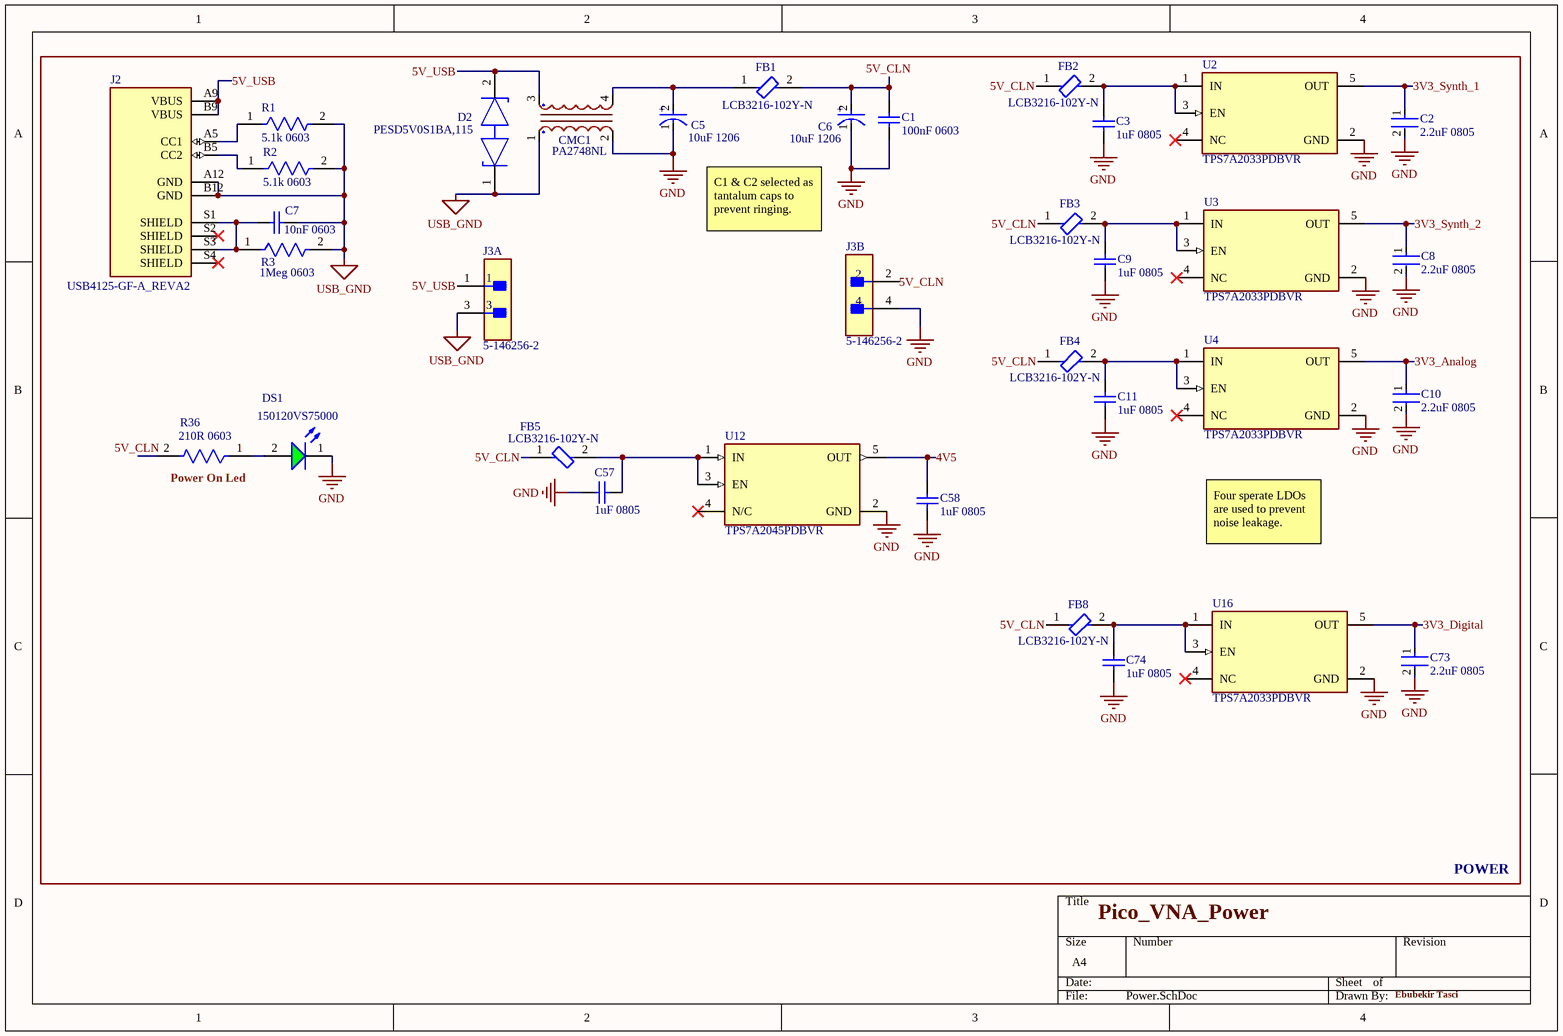
[diagram p2: Power.SchDoc]

### Parts
C1  100nF 0603  [CAPC0603(1608)100_N]
C2  2.2uF 0805  [FP-C0805C225K4RACAUTO-MFG]
C3  1uF 0805  [CAPC2013X145X50NL20T25]
C5  10uF 1206  [FP-TAJA-MFG]
C6  10uF 1206  [FP-TAJA-MFG]
C7  10nF 0603  [CAPC0603(1608)100_N]
C8  2.2uF 0805  [FP-C0805C225K4RACAUTO-MFG]
C9  1uF 0805  [CAPC2013X145X50NL20T25]
C10  2.2uF 0805  [FP-C0805C225K4RACAUTO-MFG]
C11  1uF 0805  [CAPC2013X145X50NL20T25]
C57  1uF 0805  [CAPC2013X145X50NL20T25]
C58  1uF 0805  [CAPC2013X145X50NL20T25]
C73  2.2uF 0805  [FP-C0805C225K4RACAUTO-MFG]
C74  1uF 0805  [CAPC2013X145X50NL20T25]
CMC1  PA2748NL  [DFN838P1270X560-4N]
D2  PESD5V0S1BA,115  [FP-SOD323-CA-MFG]
DS1  150120VS75000  [WL-SMCW_1206_150120xx75000]
FB1  LCB3216-102Y-N  [FP-BLM31-0_2-t1_6-IPC_C]
FB2  LCB3216-102Y-N  [FP-BLM31-0_2-t1_6-IPC_C]
FB3  LCB3216-102Y-N  [FP-BLM31-0_2-t1_6-IPC_C]
FB4  LCB3216-102Y-N  [FP-BLM31-0_2-t1_6-IPC_C]
FB5  LCB3216-102Y-N  [FP-BLM31-0_2-t1_6-IPC_C]
FB8  LCB3216-102Y-N  [FP-BLM31-0_2-t1_6-IPC_C]
J2  USB4125-GF-A_REVA2  [GCT_USB4125-GF-A_REVA2]
J3  5-146256-2  [FP-5-146256-2-MFG]  (parts A,B of 2)
R1  5.1k 0603  [FP-MCT0603-IPC_B]
R2  5.1k 0603  [FP-MCT0603-IPC_B]
R3  1Meg 0603  [FP-MCT0603-IPC_B]
R36  210R 0603  [FP-AC0603-IPC_B]
U2  TPS7A2033PDBVR  [FP-DBV0005A-MFG]
U3  TPS7A2033PDBVR  [FP-DBV0005A-MFG]
U4  TPS7A2033PDBVR  [FP-DBV0005A-MFG]
U12  TPS7A2045PDBVR  [SOT95P280X145-5N]
U16  TPS7A2033PDBVR  [FP-DBV0005A-MFG]

### Nets
GND: C1.1 C2.2 C3.1 C5.1(C) C6.1(C) C8.2 C9.1 C10.2 C11.1 C57.1 C58.1 C73.2 C74.1 CMC1.2 DS1.1(K) J3.4 U2.2(GND) U3.2(GND) U4.2(GND) U12.2(GND) U16.2(GND)
USB_GND: C7.1 CMC1.1 D2.1(K1) J2.A12(GND) J2.B12(GND) J3.3 R1.2 R2.2 R3.2
3V3_Analog: C10.1 U4.5(OUT)
3V3_Digital: C73.1 U16.5(OUT)
3V3_Synth_1: C2.1 U2.5(OUT)
3V3_Synth_2: C8.1 U3.5(OUT)
4V5: C58.2 U12.5(OUT)
5V_CLN: C1.2 C6.2(A) FB1.2 FB2.1 FB3.1 FB4.1 FB5.1 FB8.1 J3.2 R36.2
5V_USB: CMC1.3 D2.2(K2) J2.A9(VBUS) J2.B9(VBUS) J3.1
NetC3_2: C3.2 FB2.2 U2.1(IN) U2.3(EN)
NetC5_2: C5.2(A) CMC1.4 FB1.1
NetC7_2: C7.2 J2.S1(SHIELD) J2.S3(SHIELD) R3.1
NetC9_2: C9.2 FB3.2 U3.1(IN) U3.3(EN)
NetC11_2: C11.2 FB4.2 U4.1(IN) U4.3(EN)
NetC57_2: C57.2 FB5.2 U12.1(IN) U12.3(EN)
NetC74_2: C74.2 FB8.2 U16.1(IN) U16.3(EN)
NetDS1_2: DS1.2(A) R36.1
NetJ2_A5: J2.A5(CC1) R1.1
NetJ2_B5: J2.B5(CC2) R2.1

Not connected (* = marked no-connect by the designer): J2 S2(SHIELD)* S4(SHIELD)*; U2 4(NC)*; U3 4(NC)*; U4 4(NC)*; U12 4(N/C)*; U16 4(NC)*

### Notes on the sheet
- C1 & C2 selected as tantalum caps to prevent ringing.
- (near R36) Power On Led
- Four sperate LDOs are used to prevent noise leakage.
- Pico_VNA_Power
- POWER
- Ebubekir Tasci
- (in symbol CMP-1661-00004-2) +

### Library data of the parts
C1 = CMP-1035-02589-1: as C12 on sheet Main; Value: 100nF; Max Thickness: 1 mm; Technology: SMT; Rated Voltage: 25 V
C2 C8 C10 C73 = CMP-2007-03267-2: CAP CER 2.2UF 16V X7R 0805; Tolerance: 10%; Dielectric Material: Ceramic; Packaging: Cut Tape; Depth: 1.25mm; Package Quantity: 1; Case Code (Imperial): 0805; Contact Plating: Tin; REACH SVHC: No SVHC; Case/Package: 0805; Max Operating Temperature: 125°C; Thickness: 0.055inch; Height: 1.25mm; Mount: Surface Mount; Min Operating Temperature: -55°C; Construction: Flat; Series: C; Radiation Hardening: No; Capacitance: 2.2uF; Dielectric: X7R; Case Code (Metric): 2012; Length: 0.079inch; RoHS Compliant: Yes; Width: 0.049inch; Voltage Rating: 16V; Voltage Rating (DC): 16V; Ratings: AEC-Q200
C3 C9 C11 C57 C58 C74 = CMP-2007-01121-1: as C52 on sheet Main
C5 C6 = CMP-1661-00004-2: 10uF 16V  ±10% 3Ω 1206  SMD Tantalum Capacitor / TAJA106K016RNJ; ESR (Equivalent Series Resistance): 3R; Leakage Current: 1.6uA; Dissipation Factor: 8%; Polarity: Polar; Length: 3.2mm; Features: General Purpose; Voltage Rating: 16V; Voltage: 16V; Mount: Surface Mount; Case/Package: 1206; Number of Pins: 2; Case Code (Metric): 3216; Radiation Hardening: No; Min Operating Temperature: -55°C; Case Code (Imperial): 1206; Height - Seated (Max): 0.071inch; Lead Free: Lead Free; Termination: SMD/SMT; Dielectric Material: Tantalum; Width: 1.6mm; Tolerance: 10%; Capacitance: 10uF; Lead Pitch: 1.1mm; Max Operating Temperature: 125°C; Voltage Rating (DC): 16V; Packaging: Tape and Reel; Package Quantity: 1; REACH SVHC: No SVHC; Depth: 1.6mm; Height: 1.6mm
C7 = CMP-1035-02589-1: CAP 10nF 25V ±20% 0603 (1608 Metric) Thickness 1mm SMD; Case-EIA: 0603; Tolerance: Â±20%; Case-Metric: 1608; Value: 10nF; Max Thickness: 1 mm; Technology: SMT; Rated Voltage: 25 V
CMC1 = PA2748NL: CHOKE COMMON MODE 1125UH 1.8A SMD
D2 = CMP-14432-000001-1: TVS DIODE 5V 14V SOD323
DS1 = CMP-1426-00016-4: Led, Green, 570 Nm, 2 V, 30 Ma, 40 Mcd Rohs Compliant: Yes; Manufacturer Lifecycle Status: ACTIVE; Lens Style: Clear, Rectangular; YEOL: 1 = Estimated lifetime > 10 years; Forward Voltage: 2V; Max Reverse Voltage (DC): 5V; Forward Current: 100mA; Wavelength: 570nm; Luminous Intensity: 40mcd; Test Current: 20mA; Viewing Angle: 140°; Peak Wavelength: 572nm; Length: 3.2mm; Mount: Surface Mount; Case/Package: 1206; Height: 680µm; Case Code (Imperial): 1206; REACH SVHC: Unknown; Width: 1.6mm; Packaging: Tape and Reel; Min Operating Temperature: -40°C; Case Code (Metric): 3216; Max Operating Temperature: 85°C; Color: Green; RoHS: Compliant; Lifecycle Status: Production; Dominant Wavelength: 570nm
FB1-FB5 FB8 = CMP-06046-002145-1: Chip Ferrite Bead, 1206, 1kΩ @ 100MHz, max. 0.200Ω, 25%, 2A; DC Resistance (DCR): 200mR; Number of Lines: 1; Max Operating Temperature: 125°C; Max Current Rating: 2A; Min Operating Temperature: -55°C; Ratings: AEC-Q200; Case/Package: 1206; Mount: Surface Mount; Case Code (Metric): 3216; Case Code (Imperial): 1206; RoHS Compliant: Yes; Packaging: Tape and Reel
J2 = CMP-039-000000-1: Value: *; MP: USB4125-GF-A_REVA2; Design Item ID: USB4125-GF-A_REVA2; Package: None; Pin Count: 10; Source: USB4125-GF-A_REVA2.SchLib; Price: None; Component Type: Standard; Availability: Unavailable
J3 = CMP-03369-000128-1: CONN HEADER VERT 4POS 2.54MM; Connector Type: Plug; Number of Positions: 4; High Speed Serial Data Connector: No; High Temperature Housing: Yes; Strain Relief: No (Without); Contact Current Rating: 3A; Board Standoff: Yes (With); PCB Mounting Orientation: Vertical; PCB Mount Retention: Without; Contact Post Length: 0.12inch; PCB Thickness: 0.062inch; Approvals: CSA; Voltage Rating: 750V; Insulation Resistance: 5GR; Radiation Hardening: No; Packaging: Carton; Housing Color: Black; Contact Material: Bronze; Depth: 4.88mm; Row Spacing: 2.54mm; Number of Contacts: 4; Contact Shape: Square; Contact Type: Male Pin; Min Operating Temperature: -65°C; Pitch: 2.54mm; Flammability Rating: UL94 V-0; Keyed: No; Housing Material: Thermoplastic; Mount: Through Hole; Length: 4.67mm; Mating Connector Lock: No (Without); Selectively Loaded: No (Without); Contact Mating Length: 0.23inch; Contact Protection: No (Without); Contact Gender: Male; Current Rating: 3A; Number of Rows: 2; Termination: Through Hole; Color: Black; RoHS Compliant: Yes; Gasket: No (Without); Contact Plating: Gold; Max Operating Temperature: 105°C; Mating Alignment: No (Without); Series: AMPMODU MOD II; Orientation: Straight; Package Quantity: 500; Stabilizers: No (Without)
R1 R2 = CMP-02407-010205-1: RES SMD 100 OHM 1% 1/8W 0603; Resistance: 5.1kR; Tolerance: 0.1%; Temperature Coefficient: 25ppm/°C; Max Operating Temperature: 125°C; Radiation Hardening: No; Composition: Thin Film; Height: 450um; Lead Free: Lead Free; Contact Plating: Tin; Length: 1.55mm; Width: 850um; Case/Package: 0603; Min Operating Temperature: -55°C
R3 = CMP-02407-010205-1: RES SMD 1 MEGA OHM 1% 1/8W 0603; Resistance: 1MR; Tolerance: 0.1%; Temperature Coefficient: 25ppm/°C; Max Operating Temperature: 125°C; Radiation Hardening: No; Composition: Thin Film; Height: 450um; Lead Free: Lead Free; Contact Plating: Tin; Length: 1.55mm; Width: 850um; Case/Package: 0603; Min Operating Temperature: -55°C
R36 = CMP-03412-003885-2: as R11 on sheet Main; Termination: SMD/SMT; Case Code (Imperial): 0603; Width: 0.8mm; RoHS Compliant: Yes; Resistor Type: Thick Film; Max Power Dissipation: 100mW; Max Operating Temperature: 155°C; Case Code (Metric): 1608; Series: AC; Features: Moisture Resistant; Resistance: 210R; Case/Package: 0603; Packaging: Tape and Reel; Length: 0.063inch; Number of Terminations: 2; Min Operating Temperature: -55°C; Height: 0.022inch
U2-U4 U16 = CMP-04917-000300-1: IC REG LINEAR 3.3V 300MA SOT23-5; RoHS Compliant: Yes
U12 = CMP-056-000000-1: MF: {'manufacturer': u'Texas Instruments'}; Design Item ID: TPS7A2045PDBVR; Value: *; Availability: Unavailable; Pin Count: 5; MP: TPS7A2045PDBVR; Price: None; Source: TPS7A2045PDBVR.SchLib; Component Type: Standard; Package: None

## Nets that join several sheets
GND: Main (182 pins), Power (21 pins)
3V3_Analog: Main (8 pins), Power (C10.1 U4.5)
3V3_Digital: Main (8 pins), Power (C73.1 U16.5)
3V3_Synth_1: Main (18 pins), Power (C2.1 U2.5)
3V3_Synth_2: Main (18 pins), Power (C8.1 U3.5)
4V5: Main (C59.2 U11.3), Power (C58.2 U12.5)
5V_CLN: Main (9 pins), Power (10 pins)